# Altium schematic sheet LPCB218 - EXTERNAL I2C.SchDoc
size A3; Address1: Factory 10; Address2: 9-13 Dingley Avenue, Dandeong, VICTORIA 3175, AUSTRALIA; DocumentNumber: 4; Revision: 1; SheetNumber: 4; SheetTotal: 14; Lockie__PCB_SUB_ASSEMBLY: External I2C; Lockie__PCB_ASSEMBLY: Command Node; Lockie__LDL: LPCB218; Lockie__PCB_DESCRIPTION: Command Node
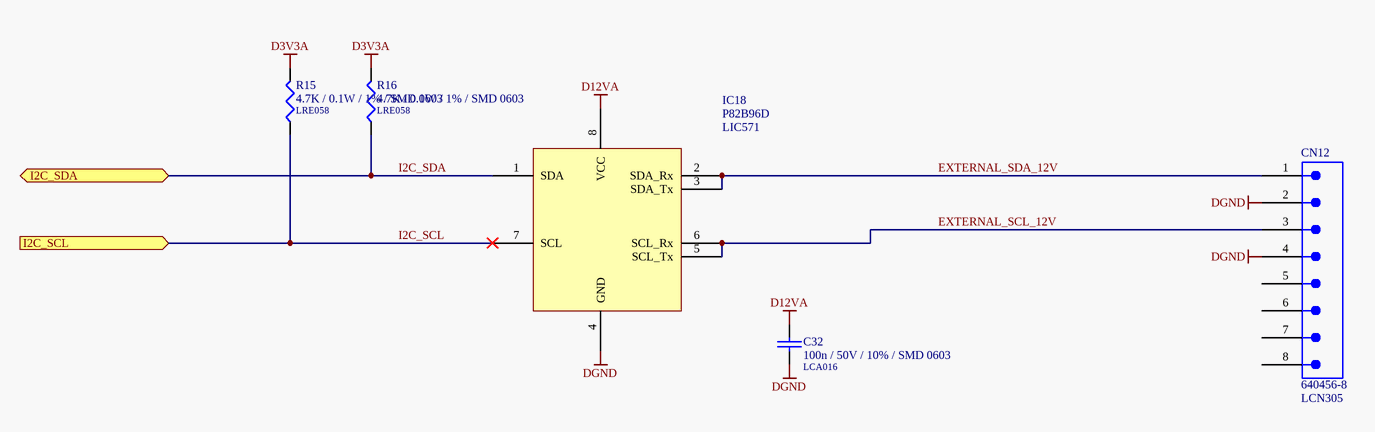
[diagram p0: LPCB218 - EXTERNAL I2C.SchDoc]

## Parts
C32  100n / 50V / 10% / SMD 0603  LDL_NUMBER: LCA016  [LFP011__CC1608-0603-IPC7351_B]
CN12  640456-8  LDL_NUMBER: LCN305  [640456-8]
IC18  P82B96D  LDL_NUMBER: LIC571  [LFP097__SOIC150-8]
R15  4.7K / 0.1W / 1% / SMD 0603  LDL_NUMBER: LRE058  [LFP020__CR1608-0603-IPC7351_B]
R16  4.7K / 0.1W / 1% / SMD 0603  LDL_NUMBER: LRE058  [LFP020__CR1608-0603-IPC7351_B]

## Ports
I2C_SCL (in), I2C_SDA (bidir)

## Nets
D3V3A: R15.2 R16.2
D12VA: C32.1 IC18.8(VCC)
DGND: C32.2 CN12.2 CN12.4 IC18.4(GND)
EXTERNAL_SCL_12V: CN12.3 IC18.5(SCL_Tx) IC18.6(SCL_Rx)
EXTERNAL_SDA_12V: CN12.1 IC18.2(SDA_Rx) IC18.3(SDA_Tx)
I2C_SCL: IC18.7(SCL) R15.1 ; port I2C_SCL
I2C_SDA: IC18.1(SDA) R16.1 ; port I2C_SDA

Not connected (* = marked no-connect by the designer): CN12 5 6 7 8

## Notes on the sheet
- PCB COMPONENT DESCRIPTION
- LDL NUMBER
- Assembly Details
- Size
- Drawing File Name
- Revision
- http://rloop.org
- Scale
- A3
- Sheet Details
- N.T.S
- Sheet:
- Of:

## Library data of the parts
C32 = 100n / 50V / 10% / SMD 0603: Capacitor, Ceramic Chip, 100nF (0.1uF), 50V, 5%, SMD 0603 [LCA016]; FMEDA__OPERATING__VOLTAGE_MIN: 0; FMEDA__OPERATING__VOLTAGE_MAX: 3.3; FMEDA__OPERATING__TEMP_MIN: -20; FMEDA__OPERATING__TEMP_TYP: 27; FMEDA__OPERATING__TEMP_MAX: 50; FMEDA__CHANNEL: COM; Value: 100n; FMEDA__FUNCTION_IN_SYSTEM: *; FMEDA__OPERATING__VOLTAGE_TYP: 3.3
CN12 = 640456-8: Connector, Male Header, 8 Way; FMEDA__CHANNEL: COM; FMEDA__OPERATING__CURRENT_MAX: 0; FMEDA__OPERATING__TEMP_MAX: 50; FMEDA__OPERATING__TEMP_MIN: -20; FMEDA__OPERATING__TEMP_TYP: 27; FMEDA__OPERATING__VOLTAGE_MAX: 16; FMEDA__OPERATING__VOLTAGE_TYP: 12; FMEDA__FUNCTION_IN_SYSTEM: *; FMEDA__OPERATING__CURRENT_MIN: 0; FMEDA__OPERATING__CURRENT_TYP: 0; FMEDA__OPERATING__VOLTAGE_MIN: 0
IC18 = P82B96D: IC, I2C Line Driver [LIC571]
R15 R16 = 4.7K / 0.1W / 1% / SMD 0603: Resistor, Ceramic Chip, 4K7, 0.1W, 1%, SMD 0603 [LRE058]; FMEDA__OPERATING__POWER_MAX: 0; FMEDA__OPERATING__TEMP_MAX: 50; FMEDA__OPERATING__TEMP_MIN: -20; FMEDA__OPERATING__TEMP_TYP: 27; FMEDA__CHANNEL: COM; VALUE: 4.7K; FMEDA__OPERATING__POWER_MIN: 0; FMEDA__OPERATING__VOLTAGE_MAX: 0; FMEDA__OPERATING__VOLTAGE_MIN: 0; FMEDA__OPERATING__VOLTAGE_TYP: 0; FMEDA__FUNCTION_IN_SYSTEM: *